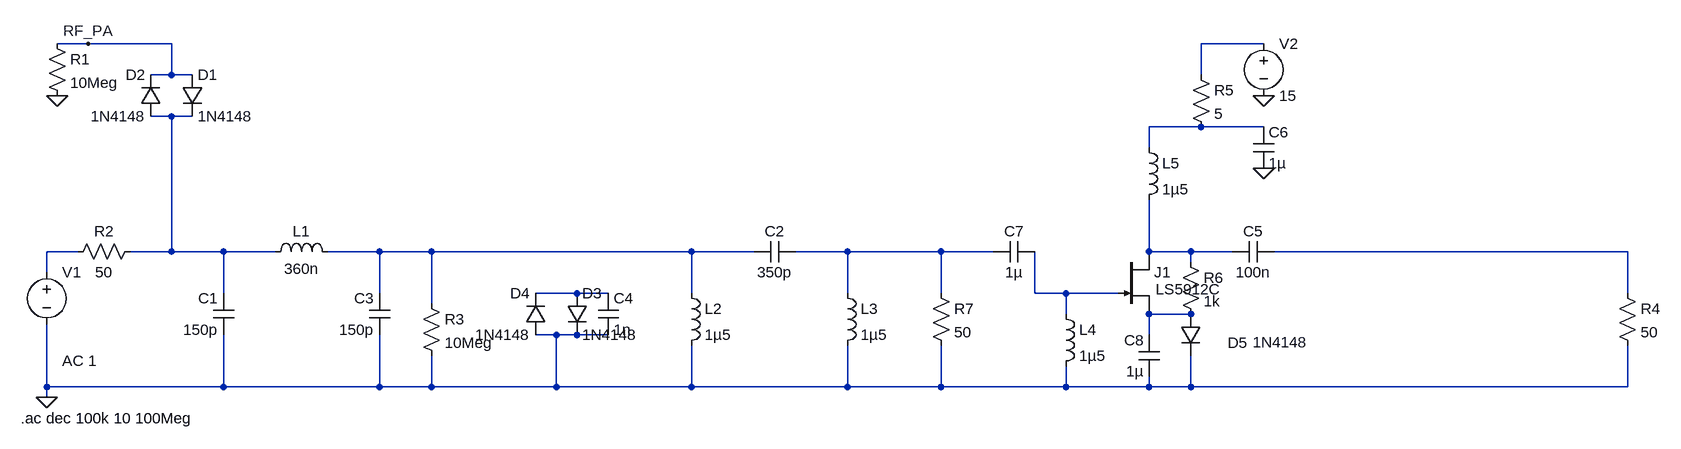
[diagram p0: schematic 22MHz Passive Switch and LNA.asc]
22MHz Passive Switch and LNA.asc, the LTspice schematic file:
Version 4
SHEET 1 2088 772
WIRE -336 -176 -384 -176
WIRE -208 -176 -336 -176
WIRE 1472 -176 1376 -176
WIRE -208 -128 -208 -176
WIRE -208 -128 -240 -128
WIRE -176 -128 -208 -128
WIRE 1376 -128 1376 -176
WIRE -208 -64 -240 -64
WIRE -176 -64 -208 -64
WIRE 1376 -48 1296 -48
WIRE 1472 -48 1376 -48
WIRE 1296 -16 1296 -48
WIRE -352 144 -400 144
WIRE -208 144 -208 -64
WIRE -208 144 -272 144
WIRE -128 144 -208 144
WIRE -48 144 -128 144
WIRE 112 144 32 144
WIRE 192 144 112 144
WIRE 592 144 192 144
WIRE 688 144 592 144
WIRE 832 144 752 144
WIRE 976 144 832 144
WIRE 1056 144 976 144
WIRE 1296 144 1296 64
WIRE 1360 144 1296 144
WIRE 1424 144 1360 144
WIRE 2032 144 1488 144
WIRE 1360 160 1360 144
WIRE -400 176 -400 144
WIRE -128 208 -128 144
WIRE 112 208 112 144
WIRE 416 208 352 208
WIRE 464 208 416 208
WIRE 592 208 592 144
WIRE 832 208 832 144
WIRE 976 208 976 144
WIRE 1120 208 1120 144
WIRE 1168 208 1120 208
WIRE 1248 208 1168 208
WIRE 2032 208 2032 144
WIRE 192 224 192 144
WIRE 1168 240 1168 208
WIRE 1296 240 1296 224
WIRE 1360 240 1296 240
WIRE 384 272 352 272
WIRE 416 272 384 272
WIRE 464 272 416 272
WIRE 1296 272 1296 240
WIRE -400 352 -400 256
WIRE -128 352 -128 272
WIRE -128 352 -400 352
WIRE 112 352 112 272
WIRE 112 352 -128 352
WIRE 192 352 192 304
WIRE 192 352 112 352
WIRE 384 352 384 272
WIRE 384 352 192 352
WIRE 592 352 592 288
WIRE 592 352 384 352
WIRE 832 352 832 288
WIRE 832 352 592 352
WIRE 976 352 976 288
WIRE 976 352 832 352
WIRE 1168 352 1168 320
WIRE 1168 352 976 352
WIRE 1296 352 1296 336
WIRE 1296 352 1168 352
WIRE 1360 352 1360 304
WIRE 1360 352 1296 352
WIRE 2032 352 2032 288
WIRE 2032 352 1360 352
WIRE -400 368 -400 352
FLAG -400 368 0
FLAG -336 -176 RF_PA
FLAG -384 -96 0
FLAG 1472 16 0
FLAG 1472 -96 0
SYMBOL ind -64 160 R270
WINDOW 0 32 56 VTop 2
WINDOW 3 5 56 VBottom 2
SYMATTR InstName L1
SYMATTR Value 360n
SYMATTR SpiceLine Rser=0.3
SYMBOL cap -112 272 R180
WINDOW 0 24 56 Left 2
WINDOW 3 24 8 Left 2
SYMATTR InstName C1
SYMATTR Value 150p
SYMATTR SpiceLine Rser=0.1
SYMBOL voltage -400 160 R0
WINDOW 123 24 152 Left 2
WINDOW 39 24 124 Left 2
SYMATTR Value2 AC 1
SYMATTR InstName V1
SYMATTR Value ""
SYMBOL res -256 128 R90
WINDOW 0 0 56 VBottom 2
WINDOW 3 32 56 VTop 2
SYMATTR InstName R2
SYMATTR Value 50
SYMBOL cap 128 272 R180
WINDOW 0 24 56 Left 2
WINDOW 3 24 8 Left 2
SYMATTR InstName C3
SYMATTR Value 150p
SYMATTR SpiceLine Rser=0.1
SYMBOL res 176 208 R0
SYMATTR InstName R3
SYMATTR Value 10Meg
SYMBOL diode -192 -128 R0
SYMATTR InstName D1
SYMATTR Value 1N4148
SYMATTR Description Schottky diode
SYMATTR Type schottky
SYMBOL diode -224 -64 R180
WINDOW 0 24 64 Left 2
WINDOW 3 24 0 Left 2
SYMATTR InstName D2
SYMATTR Value 1N4148
SYMATTR Description Schottky diode
SYMATTR Type schottky
SYMBOL res -400 -192 R0
SYMATTR InstName R1
SYMATTR Value 10Meg
SYMBOL diode 400 208 R0
SYMATTR InstName D3
SYMATTR Value 1N4148
SYMATTR Description Schottky diode
SYMATTR Type schottky
SYMBOL diode 368 272 R180
WINDOW 0 24 64 Left 2
WINDOW 3 24 0 Left 2
SYMATTR InstName D4
SYMATTR Value 1N4148
SYMATTR Description Schottky diode
SYMATTR Type schottky
SYMBOL ind 576 192 R0
SYMATTR InstName L2
SYMATTR Value 1µ5
SYMATTR SpiceLine Rser=0.3
SYMBOL ind 816 192 R0
SYMATTR InstName L3
SYMATTR Value 1µ5
SYMATTR SpiceLine Rser=0.3
SYMBOL cap 688 160 R270
WINDOW 0 32 32 VTop 2
WINDOW 3 0 32 VBottom 2
SYMATTR InstName C2
SYMATTR Value 350p
SYMATTR SpiceLine Rser=0.1
SYMBOL res 2016 192 R0
SYMATTR InstName R4
SYMATTR Value 50
SYMBOL cap 448 208 R0
SYMATTR InstName C4
SYMATTR Value 1n
SYMBOL cap 1488 128 R90
WINDOW 0 0 32 VBottom 2
WINDOW 3 32 32 VTop 2
SYMATTR InstName C5
SYMATTR Value 100n
SYMBOL ind 1152 224 R0
SYMATTR InstName L4
SYMATTR Value 1µ5
SYMATTR SpiceLine Rser=0.3
SYMBOL cap 1456 -48 R0
SYMATTR InstName C6
SYMATTR Value 1µ
SYMBOL res 1360 -144 R0
SYMATTR InstName R5
SYMATTR Value 5
SYMBOL cap 1120 128 R90
WINDOW 0 0 32 VBottom 2
WINDOW 3 32 32 VTop 2
SYMATTR InstName C7
SYMATTR Value 1µ
SYMBOL njf 1248 144 R0
WINDOW 3 58 58 Left 2
SYMATTR InstName J1
SYMATTR Value LS5912C
SYMBOL diode 1344 240 R0
WINDOW 0 73 44 Left 2
WINDOW 3 111 43 Left 2
SYMATTR InstName D5
SYMATTR Value 1N4148
SYMATTR Description Schottky diode
SYMATTR Type schottky
SYMBOL res 1344 144 R0
SYMATTR InstName R6
SYMATTR Value 1k
SYMBOL voltage 1472 -192 R0
WINDOW 123 0 0 Left 0
WINDOW 39 0 0 Left 0
SYMATTR InstName V2
SYMATTR Value 15
SYMBOL ind 1280 -32 R0
SYMATTR InstName L5
SYMATTR Value 1µ5
SYMATTR SpiceLine Rser=0.3
SYMBOL cap 1312 336 R180
WINDOW 0 24 56 Left 2
WINDOW 3 24 8 Left 2
SYMATTR InstName C8
SYMATTR Value 1µ
SYMBOL res 960 192 R0
SYMATTR InstName R7
SYMATTR Value 50
TEXT -440 400 Left 2 !.ac dec 100k 10 100Meg

The netlist it stands for:
* 22MHz Passive Switch and LNA.asc
L1 N002 N005 360n Rser=0.3
C1 0 N002 150p Rser=0.1
V1 N004 0 AC 1
R2 N002 N004 50
C3 0 N005 150p Rser=0.1
R3 N005 0 10Meg
D1 RF_PA N002 1N4148
D2 N002 RF_PA 1N4148
R1 RF_PA 0 10Meg
D3 N009 0 1N4148
D4 0 N009 1N4148
L2 N005 0 1µ5 Rser=0.3
L3 N006 0 1µ5 Rser=0.3
C2 N005 N006 350p Rser=0.1
R4 N008 0 50
C4 N009 0 1n
C5 N008 N007 100n
L4 N010 0 1µ5 Rser=0.3
C6 N003 0 1µ
R5 N001 N003 5
C7 N010 N006 1µ
J1 N007 N010 N011 LS5912C
D5 N011 0 1N4148
R6 N007 N011 1k
V2 N001 0 15
L5 N003 N007 1µ5 Rser=0.3
C8 0 N011 1µ
R7 N006 0 50
.model D D
.lib standard.dio
.model NJF NJF
.model PJF PJF
.lib standard.jft
.ac dec 100k 10 100Meg
.backanno
.end